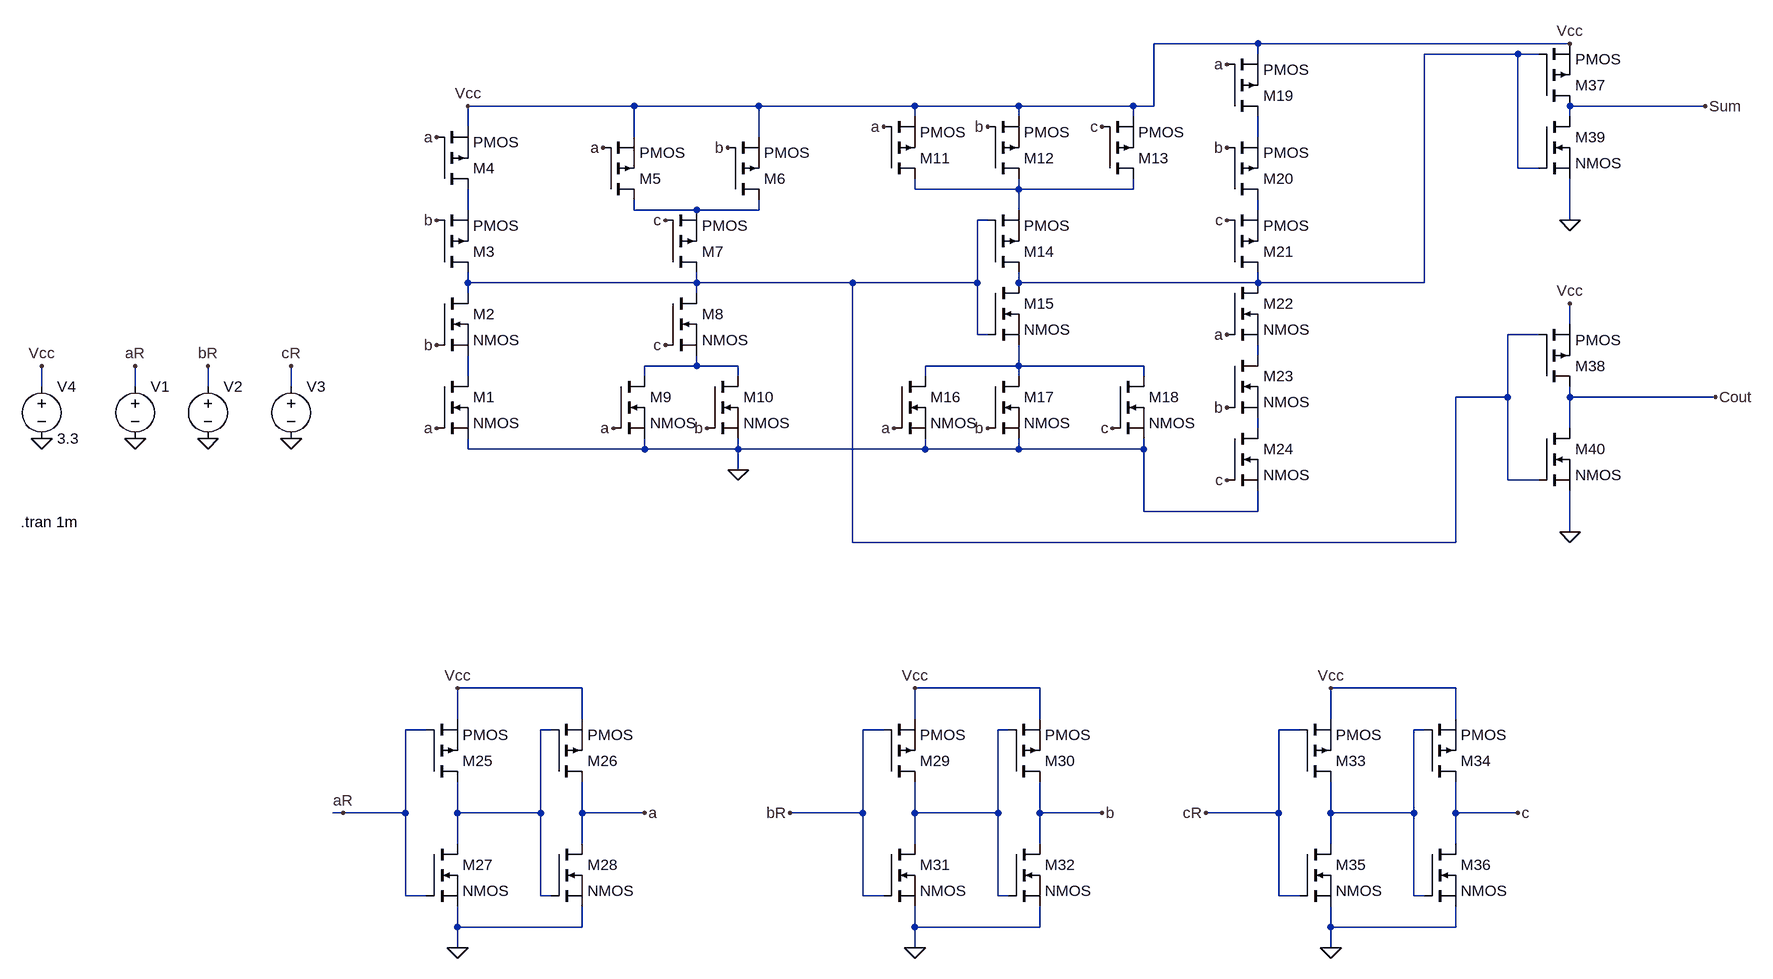
[diagram p0: schematic fulladder.asc]
fulladder.asc, the LTspice schematic file:
Version 4.1
SHEET 1 2120 1172
WIRE 1344 -240 1184 -240
WIRE 1824 -240 1344 -240
WIRE 1344 -224 1344 -240
WIRE 1744 -224 1600 -224
WIRE 1776 -224 1744 -224
WIRE 384 -144 128 -144
WIRE 576 -144 384 -144
WIRE 816 -144 576 -144
WIRE 976 -144 816 -144
WIRE 1152 -144 976 -144
WIRE 1184 -144 1184 -240
WIRE 1184 -144 1152 -144
WIRE 2032 -144 1824 -144
WIRE 816 -128 816 -144
WIRE 976 -128 976 -144
WIRE 1152 -128 1152 -144
WIRE 1824 -128 1824 -144
WIRE 128 -112 128 -144
WIRE 384 -96 384 -144
WIRE 576 -96 576 -144
WIRE 1344 -96 1344 -128
WIRE 1744 -48 1744 -224
WIRE 1776 -48 1744 -48
WIRE 816 -16 816 -32
WIRE 976 -16 976 -32
WIRE 976 -16 816 -16
WIRE 1152 -16 1152 -32
WIRE 1152 -16 976 -16
WIRE 128 16 128 -16
WIRE 384 16 384 0
WIRE 480 16 384 16
WIRE 576 16 576 0
WIRE 576 16 480 16
WIRE 976 16 976 -16
WIRE 1344 16 1344 0
WIRE 928 32 912 32
WIRE 1824 32 1824 -32
WIRE 128 128 128 112
WIRE 480 128 480 112
WIRE 480 128 128 128
WIRE 720 128 480 128
WIRE 912 128 912 32
WIRE 912 128 720 128
WIRE 976 128 976 112
WIRE 1344 128 1344 112
WIRE 1344 128 976 128
WIRE 1600 128 1600 -224
WIRE 1600 128 1344 128
WIRE 128 144 128 128
WIRE 480 144 480 128
WIRE 1824 192 1824 160
WIRE 912 208 912 128
WIRE 928 208 912 208
WIRE 1776 208 1728 208
WIRE 1344 240 1344 224
WIRE 480 256 480 240
WIRE 480 256 400 256
WIRE 544 256 480 256
WIRE 976 256 976 224
WIRE 976 256 832 256
WIRE 1168 256 976 256
WIRE 128 272 128 240
WIRE 400 272 400 256
WIRE 544 272 544 256
WIRE 832 272 832 256
WIRE 976 272 976 256
WIRE 1168 272 1168 256
WIRE -528 288 -528 256
WIRE -384 288 -384 256
WIRE -272 288 -272 256
WIRE -144 288 -144 256
WIRE 1728 304 1728 208
WIRE 1728 304 1648 304
WIRE 1824 304 1824 288
WIRE 2048 304 1824 304
WIRE 1344 352 1344 336
WIRE 1824 352 1824 304
WIRE 128 384 128 368
WIRE 400 384 400 368
WIRE 400 384 128 384
WIRE 544 384 544 368
WIRE 544 384 400 384
WIRE 832 384 832 368
WIRE 832 384 544 384
WIRE 976 384 976 368
WIRE 976 384 832 384
WIRE 1168 384 1168 368
WIRE 1168 384 976 384
WIRE 544 416 544 384
WIRE 1728 432 1728 304
WIRE 1776 432 1728 432
WIRE 1168 480 1168 384
WIRE 1344 480 1344 448
WIRE 1344 480 1168 480
WIRE 1824 512 1824 448
WIRE 720 528 720 128
WIRE 1648 528 1648 304
WIRE 1648 528 720 528
WIRE 304 752 112 752
WIRE 1008 752 816 752
WIRE 1648 752 1456 752
WIRE 112 800 112 752
WIRE 304 800 304 752
WIRE 816 800 816 752
WIRE 1008 800 1008 752
WIRE 1456 800 1456 752
WIRE 1648 800 1648 752
WIRE 64 816 32 816
WIRE 256 816 240 816
WIRE 768 816 736 816
WIRE 960 816 944 816
WIRE 1408 816 1376 816
WIRE 1600 816 1584 816
WIRE -64 944 -80 944
WIRE 32 944 32 816
WIRE 32 944 -64 944
WIRE 112 944 112 896
WIRE 240 944 240 816
WIRE 240 944 112 944
WIRE 304 944 304 896
WIRE 400 944 304 944
WIRE 736 944 736 816
WIRE 736 944 624 944
WIRE 816 944 816 896
WIRE 944 944 944 816
WIRE 944 944 816 944
WIRE 1008 944 1008 896
WIRE 1104 944 1008 944
WIRE 1376 944 1376 816
WIRE 1376 944 1264 944
WIRE 1456 944 1456 896
WIRE 1584 944 1584 816
WIRE 1584 944 1456 944
WIRE 1648 944 1648 896
WIRE 1744 944 1648 944
WIRE 112 992 112 944
WIRE 304 992 304 944
WIRE 816 992 816 944
WIRE 1008 992 1008 944
WIRE 1456 992 1456 944
WIRE 1648 992 1648 944
WIRE 32 1072 32 944
WIRE 64 1072 32 1072
WIRE 240 1072 240 944
WIRE 256 1072 240 1072
WIRE 736 1072 736 944
WIRE 768 1072 736 1072
WIRE 944 1072 944 944
WIRE 960 1072 944 1072
WIRE 1376 1072 1376 944
WIRE 1408 1072 1376 1072
WIRE 1584 1072 1584 944
WIRE 1600 1072 1584 1072
WIRE 112 1120 112 1088
WIRE 304 1120 304 1088
WIRE 304 1120 112 1120
WIRE 816 1120 816 1088
WIRE 1008 1120 1008 1088
WIRE 1008 1120 816 1120
WIRE 1456 1120 1456 1088
WIRE 1648 1120 1648 1088
WIRE 1648 1120 1456 1120
WIRE 112 1152 112 1120
WIRE 816 1152 816 1120
WIRE 1456 1152 1456 1120
FLAG -384 368 0
FLAG -272 368 0
FLAG -144 368 0
FLAG -384 256 aR
FLAG -272 256 bR
FLAG -144 256 cR
FLAG 432 32 c
FLAG 432 224 c
FLAG 336 -80 a
FLAG 352 352 a
FLAG 80 -96 a
FLAG 80 352 a
FLAG 80 32 b
FLAG 80 224 b
FLAG 528 -80 b
FLAG 496 352 b
FLAG 768 -112 a
FLAG 784 352 a
FLAG 928 352 b
FLAG 928 -112 b
FLAG 1104 -112 c
FLAG 1120 352 c
FLAG 1296 -208 a
FLAG 1296 208 a
FLAG 1296 -80 b
FLAG 1296 320 b
FLAG 1296 32 c
FLAG 1296 432 c
FLAG -528 368 0
FLAG -528 256 Vcc
FLAG 128 -144 Vcc
FLAG 544 416 0
FLAG 112 1152 0
FLAG 112 752 Vcc
FLAG 816 1152 0
FLAG 816 752 Vcc
FLAG 1456 1152 0
FLAG 1456 752 Vcc
FLAG -64 944 aR
FLAG 400 944 a
FLAG 624 944 bR
FLAG 1104 944 b
FLAG 1264 944 cR
FLAG 1744 944 c
FLAG 1824 512 0
FLAG 1824 32 0
FLAG 1824 -240 Vcc
FLAG 1824 160 Vcc
FLAG 2032 -144 Sum
FLAG 2048 304 Cout
SYMBOL nmos 80 272 R0
SYMATTR InstName M1
SYMBOL nmos 80 144 R0
SYMATTR InstName M2
SYMBOL pmos 80 112 M180
SYMATTR InstName M3
SYMBOL pmos 80 -16 M180
SYMATTR InstName M4
SYMBOL nmos 432 144 R0
SYMATTR InstName M8
SYMBOL nmos 352 272 R0
SYMATTR InstName M9
SYMBOL nmos 496 272 R0
SYMATTR InstName M10
SYMBOL voltage -384 272 R0
WINDOW 3 24 96 Invisible 2
WINDOW 123 0 0 Left 0
WINDOW 39 0 0 Left 0
SYMATTR InstName V1
SYMATTR Value PULSE(0 3.3 0 0 0 0.1m 0.2m 100)
SYMBOL voltage -272 272 R0
WINDOW 3 24 96 Invisible 2
WINDOW 123 0 0 Left 0
WINDOW 39 0 0 Left 0
SYMATTR InstName V2
SYMATTR Value PULSE(0 3.3 0 0 0 0.2m 0.4m 100)
SYMBOL voltage -144 272 R0
WINDOW 3 24 96 Invisible 2
WINDOW 123 0 0 Left 0
WINDOW 39 0 0 Left 0
SYMATTR InstName V3
SYMATTR Value PULSE(0 3.3 0 0 0 0.4m 0.8m 100)
SYMBOL pmos 336 0 M180
SYMATTR InstName M5
SYMBOL pmos 528 0 M180
SYMATTR InstName M6
SYMBOL pmos 432 112 M180
SYMATTR InstName M7
SYMBOL pmos 768 -32 M180
SYMATTR InstName M11
SYMBOL pmos 928 -32 M180
SYMATTR InstName M12
SYMBOL pmos 1104 -32 M180
SYMATTR InstName M13
SYMBOL pmos 928 112 M180
SYMATTR InstName M14
SYMBOL nmos 928 128 R0
SYMATTR InstName M15
SYMBOL nmos 784 272 R0
SYMATTR InstName M16
SYMBOL nmos 928 272 R0
SYMATTR InstName M17
SYMBOL nmos 1120 272 R0
SYMATTR InstName M18
SYMBOL pmos 1296 -128 M180
SYMATTR InstName M19
SYMBOL nmos 1296 128 R0
SYMATTR InstName M22
SYMBOL nmos 1296 240 R0
SYMATTR InstName M23
SYMBOL nmos 1296 352 R0
SYMATTR InstName M24
SYMBOL voltage -528 272 R0
WINDOW 123 0 0 Left 0
WINDOW 39 0 0 Left 0
SYMATTR InstName V4
SYMATTR Value 3.3
SYMBOL pmos 1296 0 M180
SYMATTR InstName M20
SYMBOL pmos 1296 112 M180
SYMATTR InstName M21
SYMBOL pmos 64 896 M180
SYMATTR InstName M25
SYMBOL pmos 256 896 M180
SYMATTR InstName M26
SYMBOL nmos 64 992 R0
SYMATTR InstName M27
SYMBOL nmos 256 992 R0
SYMATTR InstName M28
SYMBOL pmos 768 896 M180
SYMATTR InstName M29
SYMBOL pmos 960 896 M180
SYMATTR InstName M30
SYMBOL nmos 768 992 R0
SYMATTR InstName M31
SYMBOL nmos 960 992 R0
SYMATTR InstName M32
SYMBOL pmos 1408 896 M180
SYMATTR InstName M33
SYMBOL pmos 1600 896 M180
SYMATTR InstName M34
SYMBOL nmos 1408 992 R0
SYMATTR InstName M35
SYMBOL nmos 1600 992 R0
SYMATTR InstName M36
SYMBOL pmos 1776 -144 M180
SYMATTR InstName M37
SYMBOL pmos 1776 288 M180
SYMATTR InstName M38
SYMBOL nmos 1776 -128 R0
SYMATTR InstName M39
SYMBOL nmos 1776 352 R0
SYMATTR InstName M40
TEXT -560 496 Left 2 !.tran 1m

The netlist it stands for:
* fulladder.asc
M1 N011 a 0 0 NMOS
M2 N007 b N011 N011 NMOS
M3 N007 b N004 N004 PMOS
M4 N004 a Vcc Vcc PMOS
M8 N007 c N009 N009 NMOS
M9 N009 a 0 0 NMOS
M10 N009 b 0 0 NMOS
V1 aR 0 PULSE(0 3.3 0 0 0 0.1m 0.2m 100)
V2 bR 0 PULSE(0 3.3 0 0 0 0.2m 0.4m 100)
V3 cR 0 PULSE(0 3.3 0 0 0 0.4m 0.8m 100)
M5 N005 a Vcc Vcc PMOS
M6 N005 b Vcc Vcc PMOS
M7 N007 c N005 N005 PMOS
M11 N003 a Vcc Vcc PMOS
M12 N003 b Vcc Vcc PMOS
M13 N003 c Vcc Vcc PMOS
M14 N001 N007 N003 N003 PMOS
M15 N001 N007 N010 N010 NMOS
M16 N010 a 0 0 NMOS
M17 N010 b 0 0 NMOS
M18 N010 c 0 0 NMOS
M19 N002 a Vcc Vcc PMOS
M22 N001 a N008 N008 NMOS
M23 N008 b N012 N012 NMOS
M24 N012 c 0 0 NMOS
V4 Vcc 0 3.3
M20 N006 b N002 N002 PMOS
M21 N001 c N006 N006 PMOS
M25 N013 aR Vcc Vcc PMOS
M26 a N013 Vcc Vcc PMOS
M27 N013 aR 0 0 NMOS
M28 a N013 0 0 NMOS
M29 N014 bR Vcc Vcc PMOS
M30 b N014 Vcc Vcc PMOS
M31 N014 bR 0 0 NMOS
M32 b N014 0 0 NMOS
M33 N015 cR Vcc Vcc PMOS
M34 c N015 Vcc Vcc PMOS
M35 N015 cR 0 0 NMOS
M36 c N015 0 0 NMOS
M37 Sum N001 Vcc Vcc PMOS
M38 Cout N007 Vcc Vcc PMOS
M39 Sum N001 0 0 NMOS
M40 Cout N007 0 0 NMOS
.model NMOS NMOS
.model PMOS PMOS
.lib standard.mos
.tran 1m
.backanno
.end